# Altium schematic sheet Motherboard.SchDoc
size B
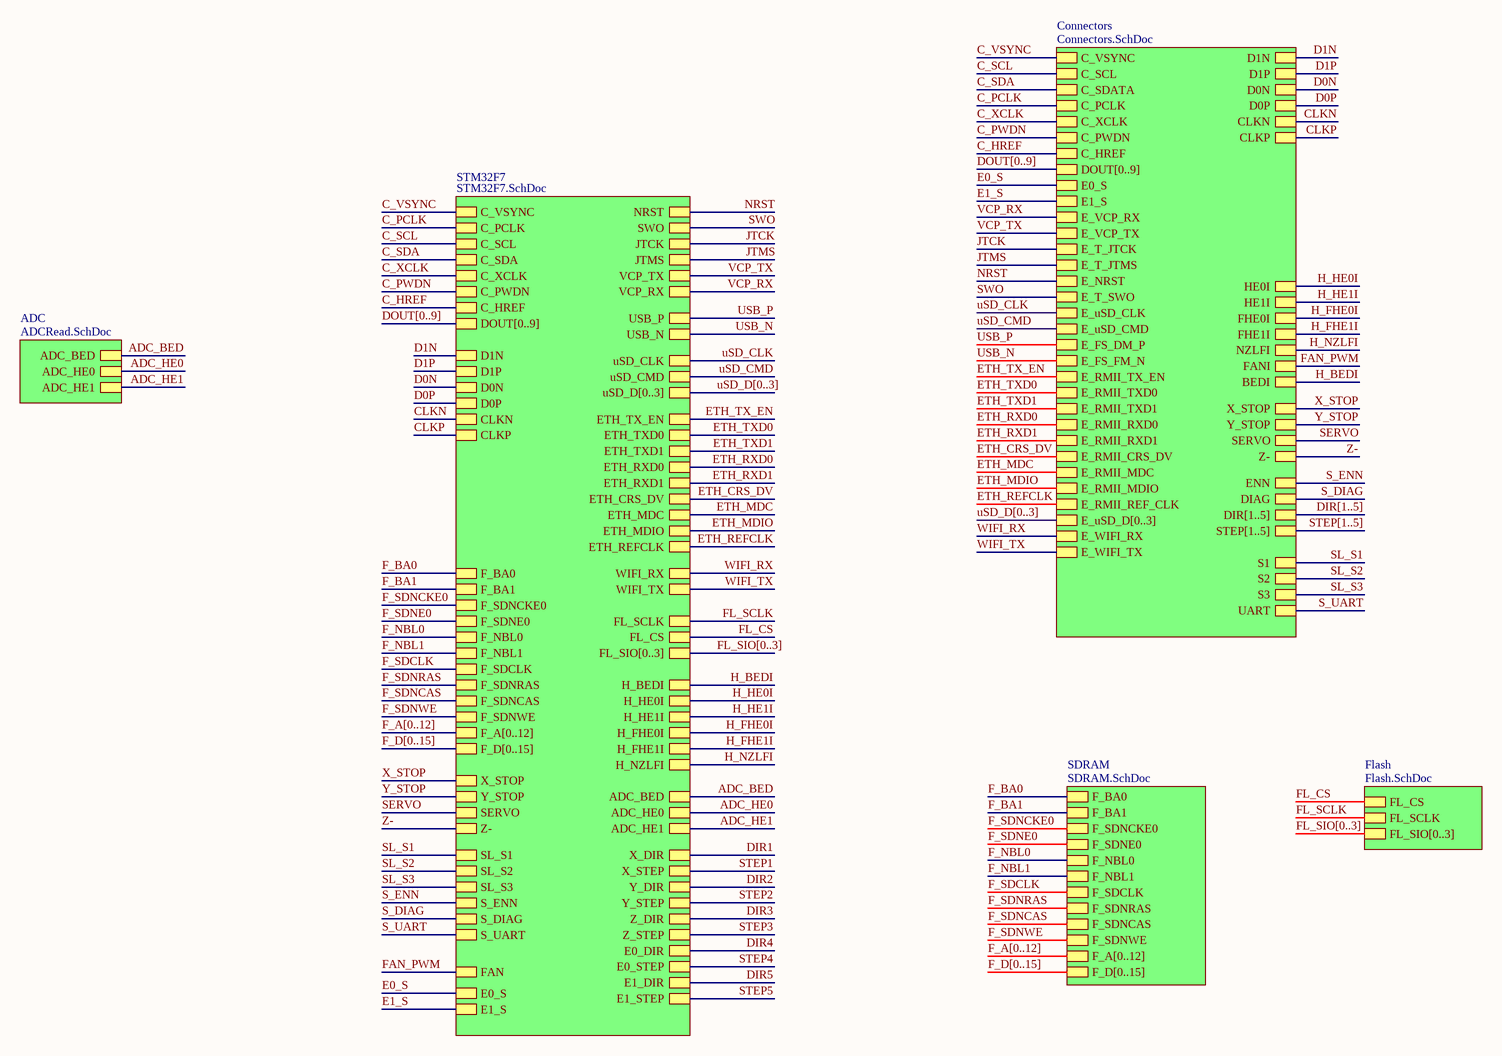
[diagram p0: Motherboard.SchDoc]

## Sub-sheets
ADC = ADCRead.SchDoc: ADC_BED, ADC_HE0, ADC_HE1
Connectors = Connectors.SchDoc: C_VSYNC, C_SCL, C_SDATA, C_PCLK, C_XCLK, C_PWDN, C_HREF, DOUT[0..9], E_VCP_RX, E_VCP_TX, E_T_JTCK, E_T_JTMS, E_NRST, E_T_SWO, E_uSD_CLK, E_uSD_CMD, E_FS_DM_P, E_FS_FM_N, E_RMII_TX_EN, E_RMII_TXD0, E_RMII_TXD1, E_RMII_RXD0, E_RMII_RXD1, E_RMII_CRS_DV, E_RMII_MDC, E_RMII_MDIO, E_RMII_REF_CLK, E_uSD_D[0..3], E_WIFI_RX, E_WIFI_TX, X_STOP, Y_STOP, SERVO, Z-, E0_S, E1_S, BEDI, FANI, FHE1I, HE1I, FHE0I, NZLFI, HE0I, ENN, STEP[1..5], DIR[1..5], DIAG, UART, S1, S2, S3, D1N, D1P, D0N, D0P, CLKN, CLKP
Flash = Flash.SchDoc: FL_CS, FL_SCLK, FL_SIO[0..3]
SDRAM = SDRAM.SchDoc: F_BA0, F_BA1, F_SDNCKE0, F_SDNE0, F_NBL0, F_NBL1, F_SDCLK, F_SDNRAS, F_SDNCAS, F_SDNWE, F_A[0..12], F_D[0..15]
STM32F7 = STM32F7.SchDoc: NRST, SWO, JTCK, JTMS, VCP_TX, VCP_RX, USB_P, USB_N, uSD_CLK, uSD_CMD, uSD_D[0..3], ETH_TX_EN, ETH_TXD0, ETH_TXD1, ETH_RXD0, ETH_RXD1, ETH_CRS_DV, ETH_MDC, ETH_MDIO, ETH_REFCLK, WIFI_RX, WIFI_TX, C_VSYNC, C_PCLK, C_SCL, C_SDA, C_XCLK, C_PWDN, C_HREF, DOUT[0..9], F_BA0, F_BA1, F_SDNCKE0, F_SDNE0, F_NBL0, F_NBL1, F_SDCLK, F_SDNRAS, F_SDNCAS, F_SDNWE, F_A[0..12], F_D[0..15], FL_SCLK, FL_CS, FL_SIO[0..3], H_BEDI, H_HE0I, H_HE1I, H_FHE0I, H_FHE1I, H_NZLFI, ADC_BED, ADC_HE0, ADC_HE1, X_STOP, Y_STOP, SERVO, Z-, SL_S1, SL_S2, SL_S3, S_ENN, S_DIAG, S_UART, X_DIR, X_STEP, Y_DIR, Y_STEP, Z_DIR, Z_STEP, E0_DIR, E0_STEP, E1_DIR, E1_STEP, FAN, E0_S, E1_S, D1N, D1P, D0N, D0P, CLKN, CLKP

## Nets
ADC_BED: sheet STM32F7/ADC_BED, sheet ADC/ADC_BED
ADC_HE0: sheet STM32F7/ADC_HE0, sheet ADC/ADC_HE0
ADC_HE1: sheet STM32F7/ADC_HE1, sheet ADC/ADC_HE1
C_HREF: sheet Connectors/C_HREF, sheet STM32F7/C_HREF
C_PCLK: sheet Connectors/C_PCLK, sheet STM32F7/C_PCLK
C_PWDN: sheet Connectors/C_PWDN, sheet STM32F7/C_PWDN
C_SCL: sheet Connectors/C_SCL, sheet STM32F7/C_SCL
C_SDA: sheet Connectors/C_SDATA, sheet STM32F7/C_SDA
C_VSYNC: sheet Connectors/C_VSYNC, sheet STM32F7/C_VSYNC
C_XCLK: sheet Connectors/C_XCLK, sheet STM32F7/C_XCLK
CLKN: sheet Connectors/CLKN, sheet STM32F7/CLKN
CLKP: sheet Connectors/CLKP, sheet STM32F7/CLKP
D0N: sheet Connectors/D0N, sheet STM32F7/D0N
D0P: sheet Connectors/D0P, sheet STM32F7/D0P
D1N: sheet Connectors/D1N, sheet STM32F7/D1N
D1P: sheet Connectors/D1P, sheet STM32F7/D1P
DIR1: sheet STM32F7/X_DIR
DIR2: sheet STM32F7/Y_DIR
DIR3: sheet STM32F7/Z_DIR
DIR4: sheet STM32F7/E0_DIR
DIR5: sheet STM32F7/E1_DIR
E0_S: sheet Connectors/E0_S, sheet STM32F7/E0_S
E1_S: sheet Connectors/E1_S, sheet STM32F7/E1_S
ETH_CRS_DV: sheet Connectors/E_RMII_CRS_DV, sheet STM32F7/ETH_CRS_DV
ETH_MDC: sheet Connectors/E_RMII_MDC, sheet STM32F7/ETH_MDC
ETH_MDIO: sheet Connectors/E_RMII_MDIO, sheet STM32F7/ETH_MDIO
ETH_REFCLK: sheet Connectors/E_RMII_REF_CLK, sheet STM32F7/ETH_REFCLK
ETH_RXD0: sheet Connectors/E_RMII_RXD0, sheet STM32F7/ETH_RXD0
ETH_RXD1: sheet Connectors/E_RMII_RXD1, sheet STM32F7/ETH_RXD1
ETH_TX_EN: sheet Connectors/E_RMII_TX_EN, sheet STM32F7/ETH_TX_EN
ETH_TXD0: sheet Connectors/E_RMII_TXD0, sheet STM32F7/ETH_TXD0
ETH_TXD1: sheet Connectors/E_RMII_TXD1, sheet STM32F7/ETH_TXD1
F_BA0: sheet STM32F7/F_BA0, sheet SDRAM/F_BA0
F_BA1: sheet STM32F7/F_BA1, sheet SDRAM/F_BA1
F_NBL0: sheet STM32F7/F_NBL0, sheet SDRAM/F_NBL0
F_NBL1: sheet STM32F7/F_NBL1, sheet SDRAM/F_NBL1
F_SDCLK: sheet STM32F7/F_SDCLK, sheet SDRAM/F_SDCLK
F_SDNCAS: sheet STM32F7/F_SDNCAS, sheet SDRAM/F_SDNCAS
F_SDNCKE0: sheet STM32F7/F_SDNCKE0, sheet SDRAM/F_SDNCKE0
F_SDNE0: sheet STM32F7/F_SDNE0, sheet SDRAM/F_SDNE0
F_SDNRAS: sheet STM32F7/F_SDNRAS, sheet SDRAM/F_SDNRAS
F_SDNWE: sheet STM32F7/F_SDNWE, sheet SDRAM/F_SDNWE
FAN_PWM: sheet Connectors/FANI, sheet STM32F7/FAN
FL_CS: sheet STM32F7/FL_CS, sheet Flash/FL_CS
FL_SCLK: sheet STM32F7/FL_SCLK, sheet Flash/FL_SCLK
H_BEDI: sheet Connectors/BEDI, sheet STM32F7/H_BEDI
H_FHE0I: sheet Connectors/FHE0I, sheet STM32F7/H_FHE0I
H_FHE1I: sheet Connectors/FHE1I, sheet STM32F7/H_FHE1I
H_HE0I: sheet Connectors/HE0I, sheet STM32F7/H_HE0I
H_HE1I: sheet Connectors/HE1I, sheet STM32F7/H_HE1I
H_NZLFI: sheet Connectors/NZLFI, sheet STM32F7/H_NZLFI
JTCK: sheet Connectors/E_T_JTCK, sheet STM32F7/JTCK
JTMS: sheet Connectors/E_T_JTMS, sheet STM32F7/JTMS
NRST: sheet Connectors/E_NRST, sheet STM32F7/NRST
S_DIAG: sheet Connectors/DIAG, sheet STM32F7/S_DIAG
S_ENN: sheet Connectors/ENN, sheet STM32F7/S_ENN
S_UART: sheet Connectors/UART, sheet STM32F7/S_UART
SERVO: sheet Connectors/SERVO, sheet STM32F7/SERVO
SL_S1: sheet Connectors/S1, sheet STM32F7/SL_S1
SL_S2: sheet Connectors/S2, sheet STM32F7/SL_S2
SL_S3: sheet Connectors/S3, sheet STM32F7/SL_S3
STEP1: sheet STM32F7/X_STEP
STEP2: sheet STM32F7/Y_STEP
STEP3: sheet STM32F7/Z_STEP
STEP4: sheet STM32F7/E0_STEP
STEP5: sheet STM32F7/E1_STEP
SWO: sheet Connectors/E_T_SWO, sheet STM32F7/SWO
USB_N: sheet Connectors/E_FS_FM_N, sheet STM32F7/USB_N
USB_P: sheet Connectors/E_FS_DM_P, sheet STM32F7/USB_P
uSD_CLK: sheet Connectors/E_uSD_CLK, sheet STM32F7/uSD_CLK
uSD_CMD: sheet Connectors/E_uSD_CMD, sheet STM32F7/uSD_CMD
VCP_RX: sheet Connectors/E_VCP_RX, sheet STM32F7/VCP_RX
VCP_TX: sheet Connectors/E_VCP_TX, sheet STM32F7/VCP_TX
WIFI_RX: sheet Connectors/E_WIFI_RX, sheet STM32F7/WIFI_RX
WIFI_TX: sheet Connectors/E_WIFI_TX, sheet STM32F7/WIFI_TX
X_STOP: sheet Connectors/X_STOP, sheet STM32F7/X_STOP
Y_STOP: sheet Connectors/Y_STOP, sheet STM32F7/Y_STOP
Z-: sheet Connectors/Z-, sheet STM32F7/Z-

## Buses and harness runs
bus DIR[1..5] = sheet Connectors/DIR[1..5]
bus DOUT[0..9] = sheet Connectors/DOUT[0..9]
bus DOUT[0..9] = sheet STM32F7/DOUT[0..9]
bus F_A[0..12] = sheet SDRAM/F_A[0..12]
bus F_A[0..12] = sheet STM32F7/F_A[0..12]
bus F_D[0..15] = sheet SDRAM/F_D[0..15]
bus F_D[0..15] = sheet STM32F7/F_D[0..15]
bus FL_SIO[0..3] = sheet Flash/FL_SIO[0..3]
bus FL_SIO[0..3] = sheet STM32F7/FL_SIO[0..3]
bus STEP[1..5] = sheet Connectors/STEP[1..5]
bus uSD_D[0..3] = sheet Connectors/E_uSD_D[0..3]
bus uSD_D[0..3] = sheet STM32F7/uSD_D[0..3]